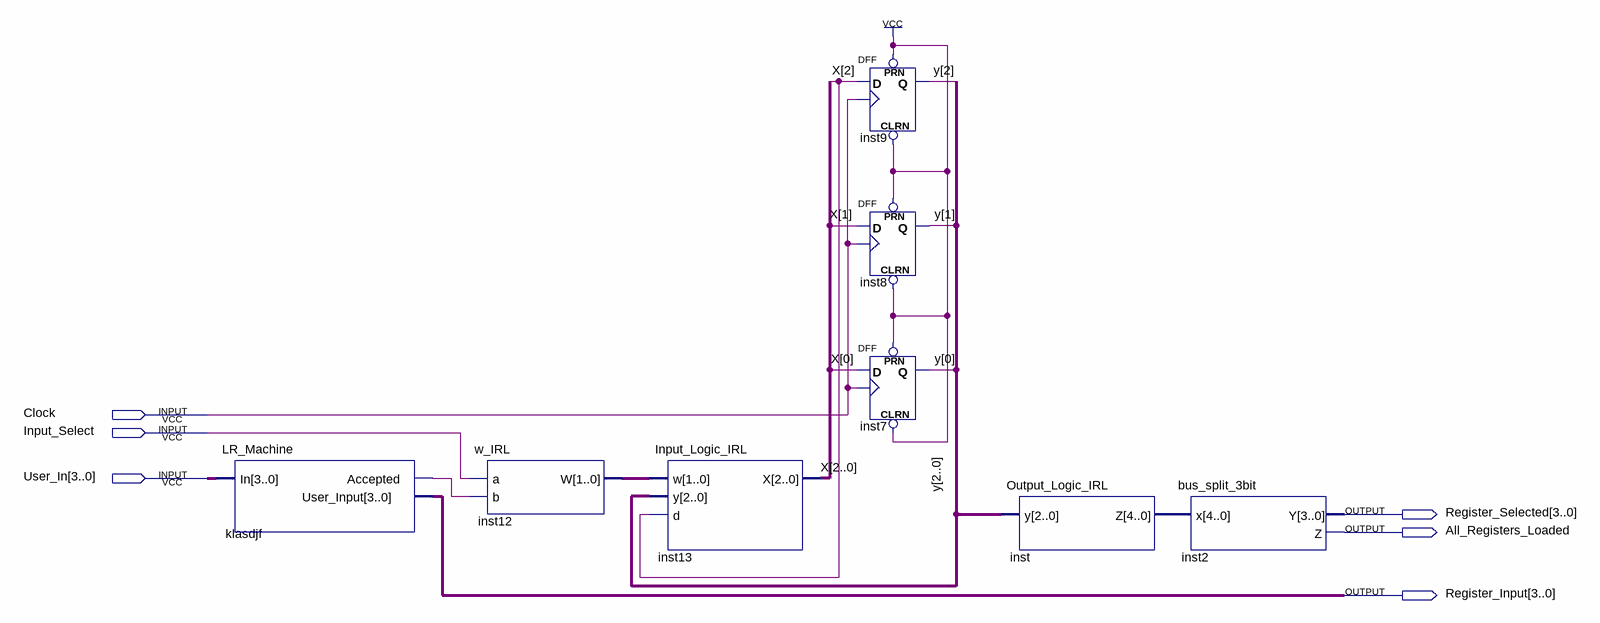
[diagram p0: schematic sheet]
// Quartus schematic IRL_Machine.bdf as structural Verilog: 8 symbols, 6 pins
module IRL_Machine (
  input  Clock,
  input  Input_Select,
  input  [3:0] User_In,
  output [3:0] Register_Selected,
  output All_Registers_Loaded,
  output [3:0] Register_Input
);

  wire klasdjf_accepted;
  wire [1:0] inst12_w;
  wire [2:0] X, y;
  wire [4:0] inst_z;

  LR_Machine klasdjf (.In(User_In), .Accepted(klasdjf_accepted), .User_Input(Register_Input));
  w_IRL inst12 (.a(Input_Select), .b(klasdjf_accepted), .W(inst12_w));
  Input_Logic_IRL inst13 (.w(inst12_w), .y(y), .d(X[2]), .X(X));
  DFF inst9 (.CLRN(1'b1), .CLK(Clock), .D(X[2]), .PRN(1'b1), .Q(y[2]));
  DFF inst8 (.CLRN(1'b1), .CLK(Clock), .D(X[1]), .PRN(1'b1), .Q(y[1]));
  DFF inst7 (.CLRN(1'b1), .CLK(Clock), .D(X[0]), .PRN(1'b1), .Q(y[0]));
  Output_Logic_IRL inst (.y(y), .Z(inst_z));
  bus_split_3bit inst2 (.x(inst_z), .Y(Register_Selected), .Z(All_Registers_Loaded));
endmodule
